# EAGLE design Controller_Board-v0-0-4 (EAGLE 5.06)
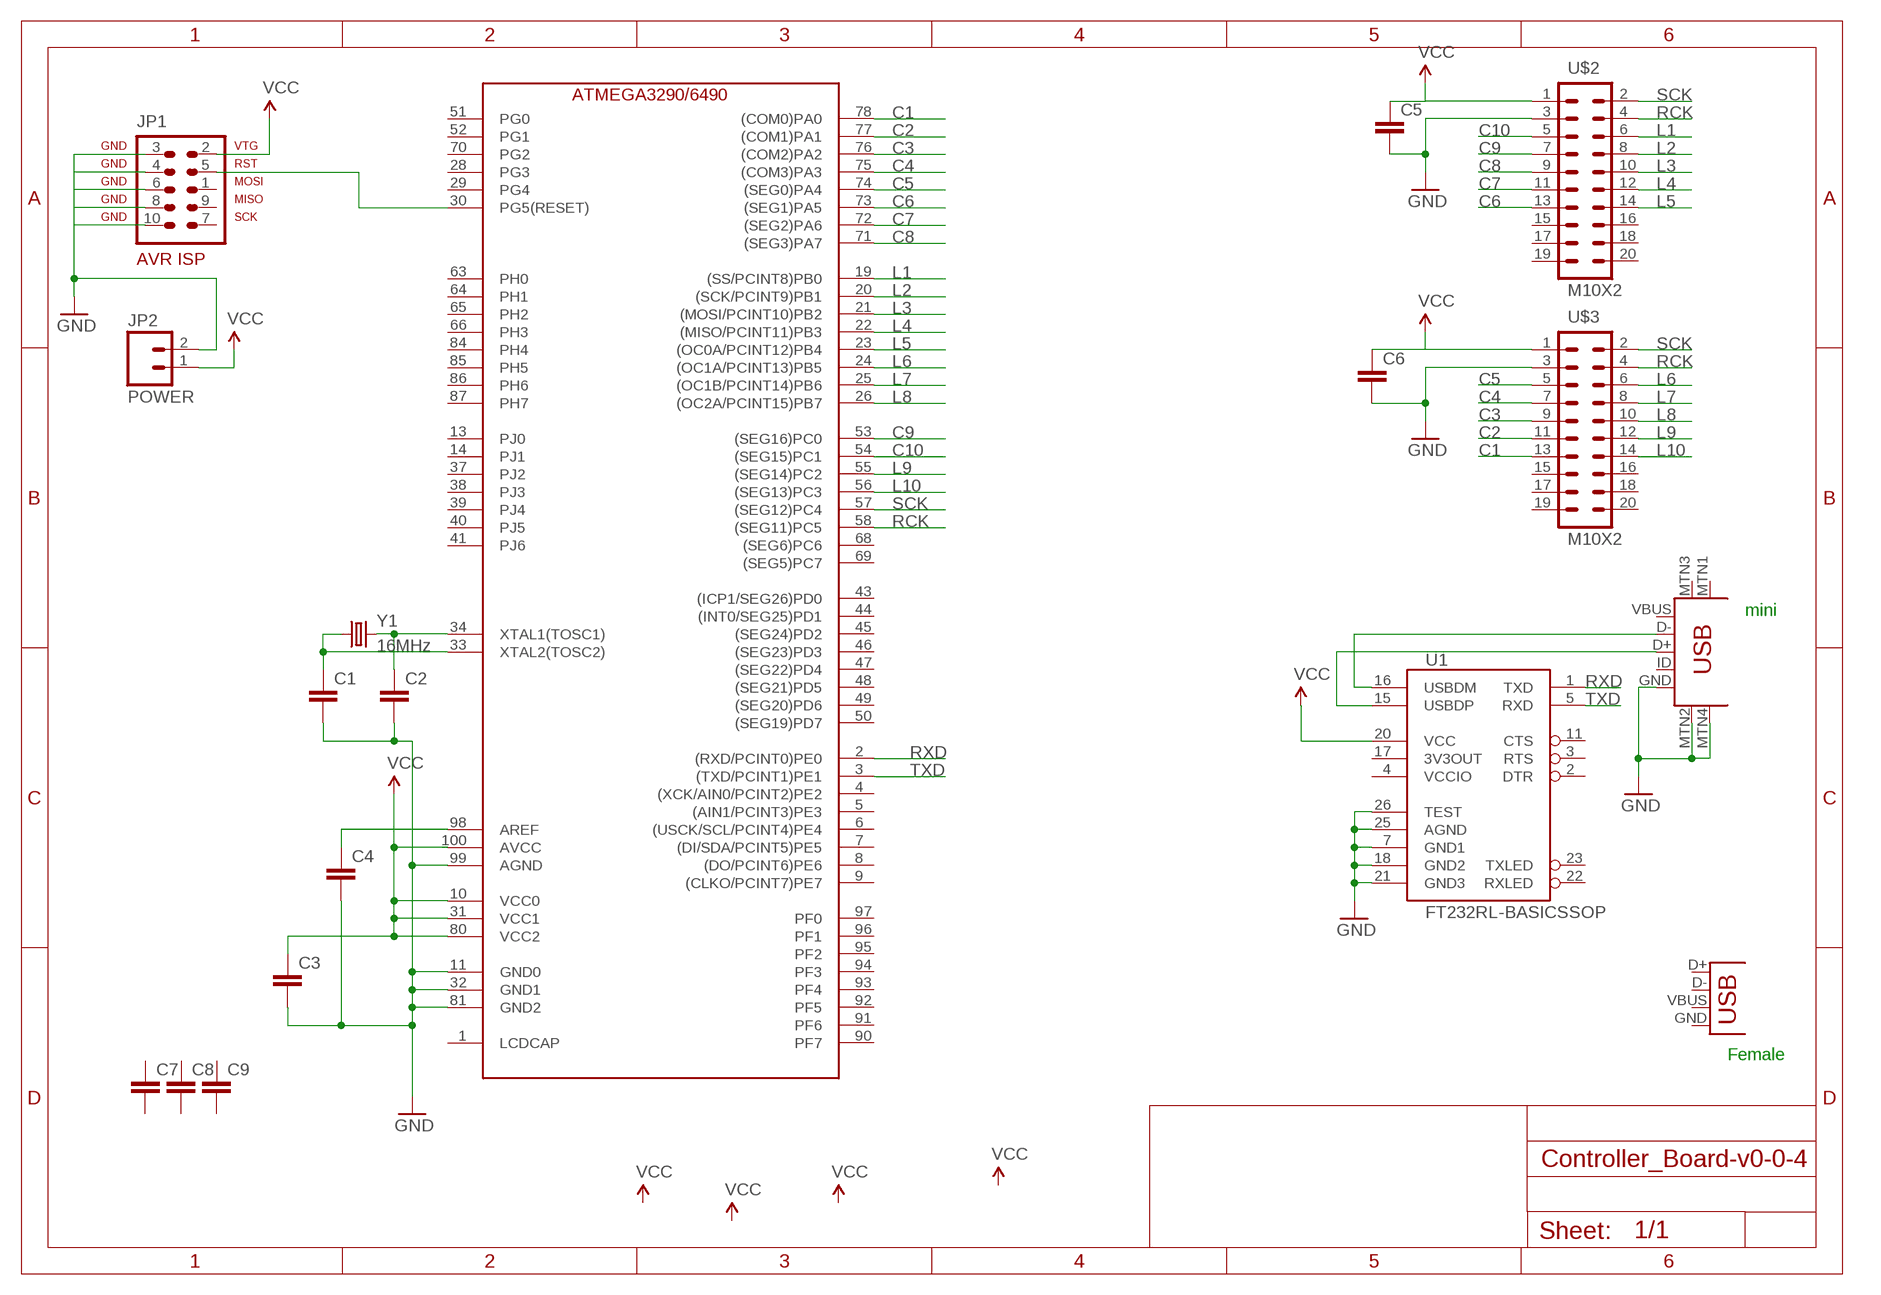
[diagram p0: schematic, sheet 1]

## Parts
C1  CAPPTH1  [CAP-PTH-5MM]
C2  CAPPTH1  [CAP-PTH-5MM]
C3  CAPPTH1  [CAP-PTH-5MM]
C4  CAPPTH1  [CAP-PTH-5MM]
C5  CAPPTH1  [CAP-PTH-5MM]
C6  CAPPTH1  [CAP-PTH-5MM]
C7  CAPPTH1  [CAP-PTH-5MM]
C8  CAPPTH1  [CAP-PTH-5MM]
C9  CAPPTH1  [CAP-PTH-5MM]
JP1  AVR-ISP-10  [AVR-ISP-10]
JP2  POWER  M02PTH  [1X02]
U1  FT232RL-BASICSSOP  [SSOP28DB]
U$1  MEGA3290  [TQFP100]
U$2  M10X2  [2X10]
U$3  M10X2  [2X10]
U$4  USB-MINIB-5PIN  [USB-MINIB]
X1  USB-A-SMD  [USB-A-S-NOSILK-FEMALE]
Y1  16MHz  CRYSTALHC49US  [HC49US]

## Nets
C1: U$1.78((COM0)PA0) U$3.13
C2: U$1.77((COM1)PA1) U$3.11
C3: U$1.76((COM2)PA2) U$3.9
C4: U$1.75((COM3)PA3) U$3.7
C5: U$1.74((SEG0)PA4) U$3.5
C6: U$1.73((SEG1)PA5) U$2.13
C7: U$1.72((SEG2)PA6) U$2.11
C8: U$1.71((SEG3)PA7) U$2.9
C9: U$1.53((SEG16)PC0) U$2.7
C10: U$1.54((SEG15)PC1) U$2.5
GND: C1.2 C2.2 C3.2 C4.2 C5.2 C6.2 JP1.3 JP1.4 JP1.6 JP1.8 JP1.10 JP2.2 U1.7(GND1) U1.18(GND2) U1.21(GND3) U1.25(AGND) U1.26(TEST) U$1.11(GND0) U$1.32(GND1) U$1.81(GND2) U$1.99(AGND) U$2.3 U$3.3 U$4.GND U$4.MTN2(MTN3) U$4.MTN4
L1: U$1.19((SS/PCINT8)PB0) U$2.6
L2: U$1.20((SCK/PCINT9)PB1) U$2.8
L3: U$1.21((MOSI/PCINT10)PB2) U$2.10
L4: U$1.22((MISO/PCINT11)PB3) U$2.12
L5: U$1.23((OC0A/PCINT12)PB4) U$2.14
L6: U$1.24((OC1A/PCINT13)PB5) U$3.6
L7: U$1.25((OC1B/PCINT14)PB6) U$3.8
L8: U$1.26((OC2A/PCINT15)PB7) U$3.10
L9: U$1.55((SEG14)PC2) U$3.12
L10: U$1.56((SEG13)PC3) U$3.14
N$1: U1.15(USBDP) U$4.D+
N$2: C4.1 U$1.98(AREF)
N$3: C2.1 U$1.34(XTAL1(TOSC1)) Y1.2
N$4: C1.1 U$1.33(XTAL2(TOSC2)) Y1.1
N$5: JP1.5 U$1.30(PG5(RESET))
N$6: U1.16(USBDM) U$4.D-
RCK: U$1.58((SEG11)PC5) U$2.4 U$3.4
RXD: U1.1(TXD) U$1.2((RXD/PCINT0)PE0)
SCK: U$1.57((SEG12)PC4) U$2.2 U$3.2
TXD: U1.5(RXD) U$1.3((TXD/PCINT1)PE1)
VCC: C3.1 C5.1 C6.1 JP1.2 JP2.1 U1.20(VCC) U$1.10(VCC0) U$1.31(VCC1) U$1.80(VCC2) U$1.100(AVCC) U$2.1 U$3.1
Unconnected: C7.1 C7.2 C8.1 C8.2 C9.1 C9.2 JP1.1 JP1.7 JP1.9 U1.2(DTR) U1.3(RTS) U1.11(CTS) U1.17(3V3OUT) U1.22(RXLED) U1.23(TXLED) U$1.1(LCDCAP) U$1.4((XCK/AIN0/PCINT2)PE2) U$1.5((AIN1/PCINT3)PE3) U$1.6((USCK/SCL/PCINT4)PE4) U$1.7((DI/SDA/PCINT5)PE5) U$1.8((DO/PCINT6)PE6) U$1.9((CLKO/PCINT7)PE7) U$1.13(PJ0) U$1.14(PJ1) U$1.28(PG3) U$1.29(PG4) U$1.37(PJ2) U$1.38(PJ3) U$1.39(PJ4) U$1.40(PJ5) U$1.41(PJ6) U$1.43((ICP1/SEG26)PD0) U$1.44((INT0/SEG25)PD1) U$1.45((SEG24)PD2) U$1.46((SEG23)PD3) U$1.47((SEG22)PD4) U$1.48((SEG21)PD5) U$1.49((SEG20)PD6) U$1.50((SEG19)PD7) U$1.51(PG0) U$1.52(PG1) U$1.63(PH0) U$1.64(PH1) U$1.65(PH2) U$1.66(PH3) U$1.68((SEG6)PC6) U$1.69((SEG5)PC7) U$1.70(PG2) U$1.84(PH4) U$1.85(PH5) U$1.86(PH6) U$1.87(PH7) U$1.90(PF7) U$1.91(PF6) U$1.92(PF5) U$1.93(PF4) U$1.94(PF3) U$1.95(PF2) U$1.96(PF1) U$1.97(PF0) U$2.15 U$2.16 U$2.17 U$2.18 U$2.19 U$2.20 U$3.15 U$3.16 U$3.17 U$3.18 U$3.19 U$3.20 U$4.ID U$4.MTN1(MTN2) U$4.MTN3(MTN1) U$4.VBUS X1.D+ X1.D- X1.GND X1.VBUS

## Notes on the sheet
- mini
- Female

## Power pins joined to a net without a drawn wire
VCCIO: U1.4(VCCIO)

## Library data of the parts
C1-C9 = SparkFun:CAP: Capacitor Standard 0603 ceramic capacitor, and 0.1" leaded capacitor.
JP1 = avr-7:AVR-ISP-10: AVR ISP-10 Serial Programming Header
JP2 = SparkFun:M02: Header 2 Standard 2-pin 0.1" header. Use with straight break away headers (SKU : PRT-00116), right angle break away headers (PRT-00553), swiss pins (PRT-00743), machine pins (PRT-00117), and female headers (PRT-00115). Molex polarized connector foot print use with SKU : PRT-08233 with associated crimp pins and housings.
U1 = SparkFun:FT232RL-BASIC: USB UART This is the simplified version of the FT232RL unit. Only what you need, nothing you don't. Spark Fun Electronics SKU : COM-00650
U$1 = avr-7:MEGA3290; ATMEGA3290: Microcontroller
U$2 U$3 = SparkFun:M10X2: This was SPECIALLY designed to be used with our Graphic LCD Backpack. Be sure you want to use this! It is not only staggered on each line of header holes, but IT IS ALSO offset of the center point of the top and bottom lines by 5 mil. This causes the headers to lock into place on the "standard" footprint on the LCD screen. The extra squares on the tdocu layer are there simply to reference other pins (if you were to actually populate a longer header than ten long - this is what we do with the backpacks).
U$4 = SparkFun:USB-MINIB: Mini-USB "B" connector with 5th pin broken out. Created new symbol breaking out 5th "ID" pin in mini/micro USB connector spec. See: http://en.wikipedia.org/wiki/Mini_usb#Cables. Uses same footprint as 4-pin symbol. Also added pins to connect to mounting / shield pads if required (probably not generally needed as signals aren't shielded once they leave the connector).
X1 = SparkFun:USB: USB Connectors USB-B-PTH is fully proven SKU : PRT-00139 USB-miniB is fully proven SKU : PRT-00587 USB-A-PCB is untested. USB-A-H is throughly reviewed, but untested. Spark Fun Electronics SKU : PRT-00437 USB-B-SMT is throughly reviewed, but untested. Needs silkscreen touching up. USB-A-S has not been used/tested USB-MB-H has not been used/tested
Y1 = SparkFun:CRYSTAL: Crystals Various standard crystals. Proven footprints. Spark Fun Electronics SKU : COM-00534

## Board
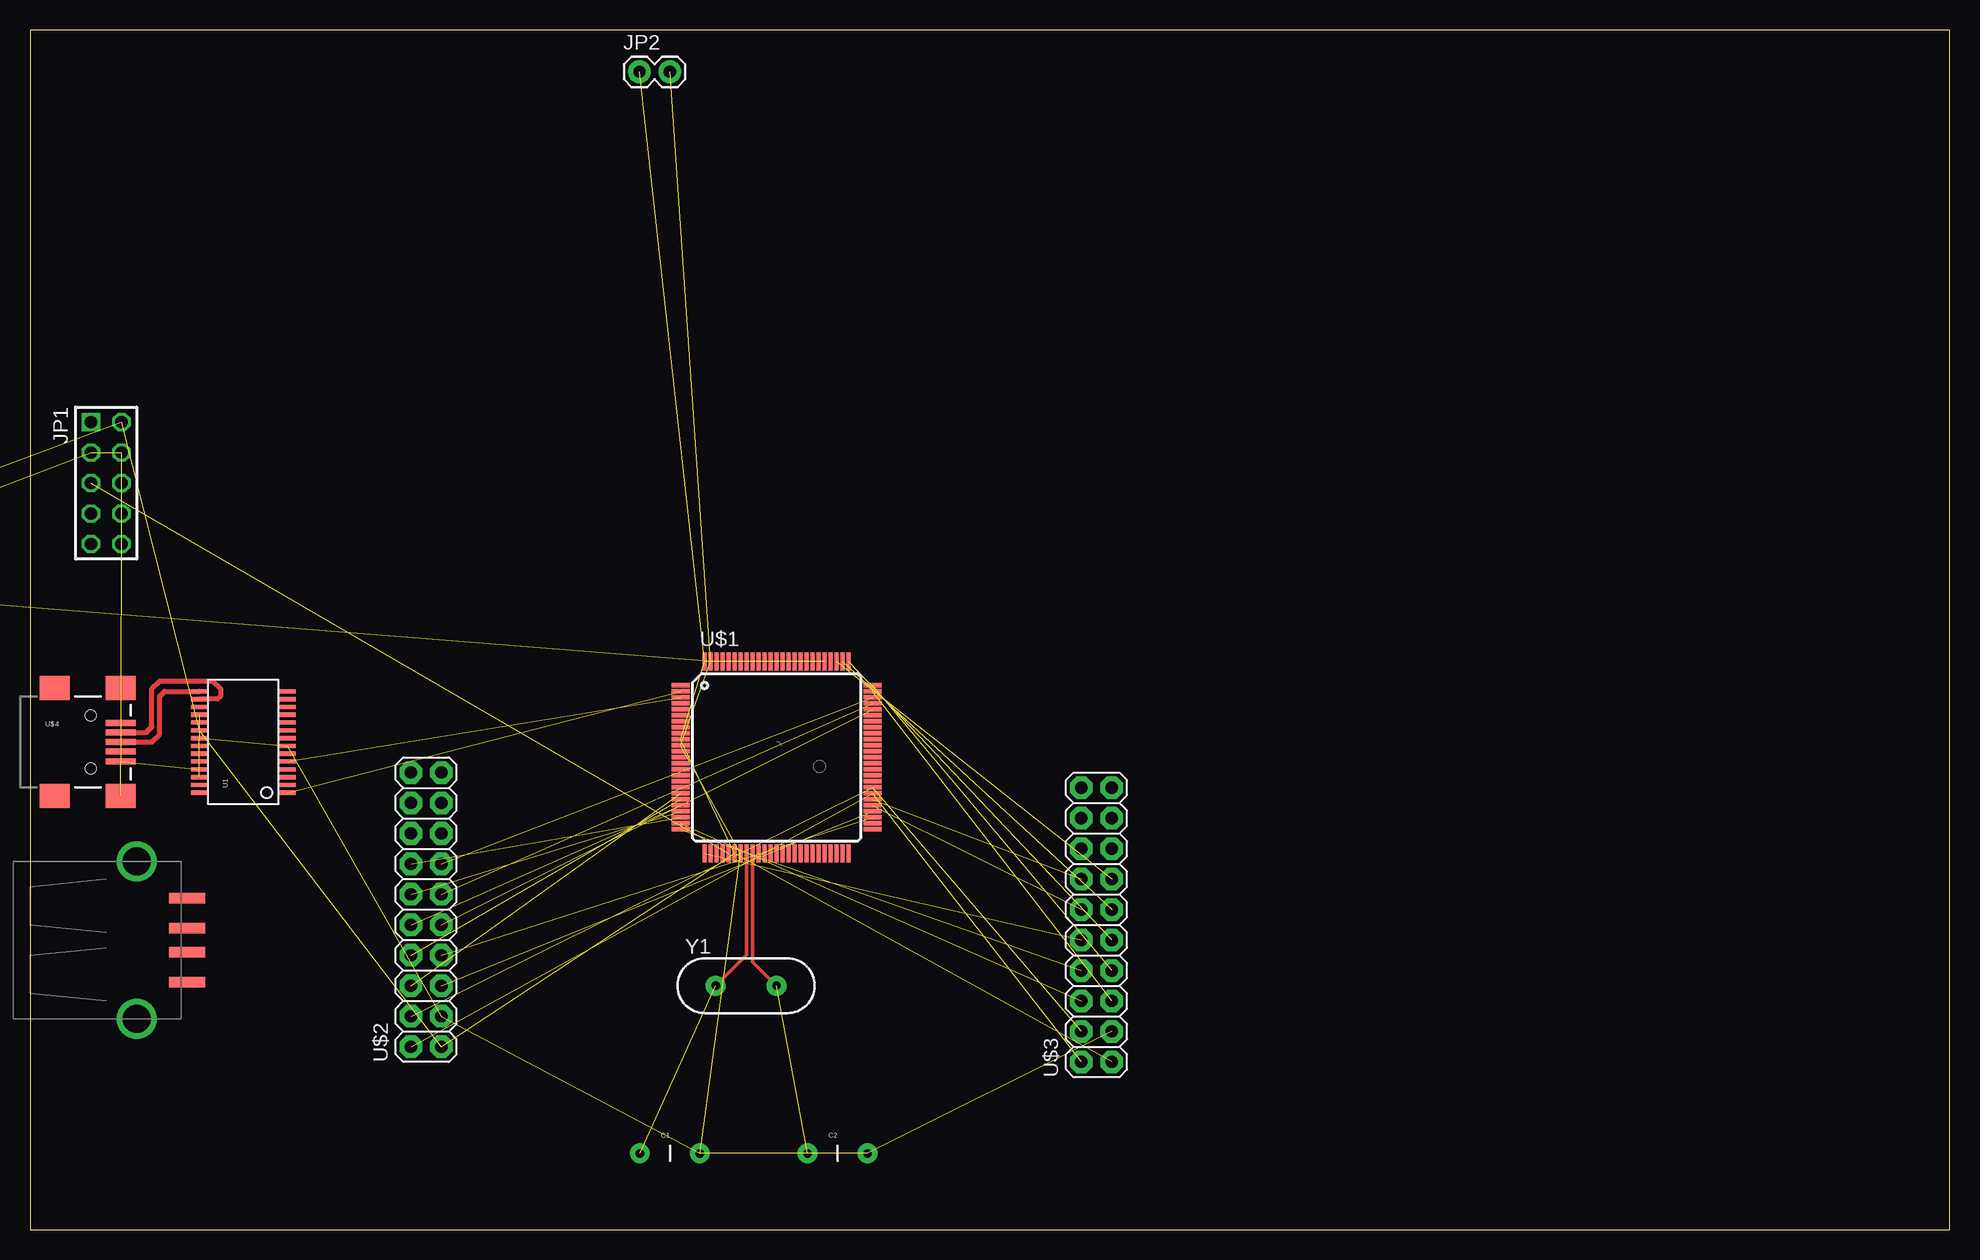
[diagram p1: board, top side]

Size 160 x 100 mm. Coordinates in mm from the lower left corner, seen from the top.
Outline: 0,0 160,0 160,100 0,100 0,0
Copper layers (1*16): Top 0.035mm / dielectric 1.5mm / Bottom 0.035mm
Design rules "default": minimum track width 10mil, minimum drill 24mil, track to track 8mil, track to pad 8mil, pad to pad 8mil, via to via 8mil, smd to smd 8mil, copper to edge 40mil, drill to drill 8mil, minimum pad ring 10mil, minimum via ring 8mil, stop-mask expansion 4mil, vias tented up to drill 0mil, thermal gap 10mil

### Footprints (pad centres in the part's own frame; a part is rotated, then mirrored left to right if it is on the bottom)
CAP-PTH-5MM = drill 0.7 pad 1.651 round: 1 -2.5,0; 2 2.5,0
AVR-ISP-10 = drill 1.016 square: 1 -5.08,-1.27 | drill 1.016 octagon: 2 -5.08,1.27; 3 -2.54,-1.27; 4 -2.54,1.27; 5 0,-1.27; 6 0,1.27; 7 2.54,-1.27; 8 2.54,1.27; 9 5.08,-1.27; 10 5.08,1.27
1X02 = drill 1.016 pad 1.88 round: 1 0,0; 2 2.54,0
SSOP28DB = smd 0.348 x 1.397: 1 -4.225,-3.656; 2 -3.575,-3.656; 3 -2.925,-3.656; 4 -2.275,-3.656; 5 -1.625,-3.656; 6 -0.975,-3.656; 7 -0.325,-3.656; 8 0.325,-3.656; 9 0.975,-3.656; 10 1.625,-3.656; 11 2.275,-3.656; 12 2.925,-3.656; 13 3.575,-3.656; 14 4.225,-3.656; 15 4.225,3.656; 16 3.575,3.656; 17 2.925,3.656; 18 2.275,3.656; 19 1.625,3.656; 20 0.975,3.656; 21 0.325,3.656; 22 -0.325,3.656; 23 -0.975,3.656; 24 -1.625,3.656; 25 -2.275,3.656; 26 -2.925,3.656; 27 -3.575,3.656; 28 -4.225,3.656
TQFP100 = smd 1.5 x 0.35: 1 -8,6; 2 -8,5.5; 3 -8,5; 4 -8,4.5; 5 -8,4; 6 -8,3.5; 7 -8,3; 8 -8,2.5; 9 -8,2; 10 -8,1.5; 11 -8,1; 12 -8,0.5; 13 -8,0; 14 -8,-0.5; 15 -8,-1; 16 -8,-1.5; 17 -8,-2; 18 -8,-2.5; 19 -8,-3; 20 -8,-3.5; 21 -8,-4; 22 -8,-4.5; 23 -8,-5; 24 -8,-5.5; 25 -8,-6; 51 8,-6; 52 8,-5.5; 53 8,-5; 54 8,-4.5; 55 8,-4; 56 8,-3.5; 57 8,-3; 58 8,-2.5; 59 8,-2; 60 8,-1.5; 61 8,-1; 62 8,-0.5; 63 8,0; 64 8,0.5; 65 8,1; 66 8,1.5; 67 8,2; 68 8,2.5; 69 8,3; 70 8,3.5; 71 8,4; 72 8,4.5; 73 8,5; 74 8,5.5; 75 8,6 | smd 0.35 x 1.5: 26 -6,-8; 27 -5.5,-8; 28 -5,-8; 29 -4.5,-8; 30 -4,-8; 31 -3.5,-8; 32 -3,-8; 33 -2.5,-8; 34 -2,-8; 35 -1.5,-8; 36 -1,-8; 37 -0.5,-8; 38 0,-8; 39 0.5,-8; 40 1,-8; 41 1.5,-8; 42 2,-8; 43 2.5,-8; 44 3,-8; 45 3.5,-8; 46 4,-8; 47 4.5,-8; 48 5,-8; 49 5.5,-8; 50 6,-8; 76 6,8; 77 5.5,8; 78 5,8; 79 4.5,8; 80 4,8; 81 3.5,8; 82 3,8; 83 2.5,8; 84 2,8; 85 1.5,8; 86 1,8; 87 0.5,8; 88 0,8; 89 -0.5,8; 90 -1,8; 91 -1.5,8; 92 -2,8; 93 -2.5,8; 94 -3,8; 95 -3.5,8; 96 -4,8; 97 -4.5,8; 98 -5,8; 99 -5.5,8; 100 -6,8
2X10 = drill 1.016 pad 1.88 octagon: 1 -11.43,-1.27; 2 -11.43,1.27; 3 -8.89,-1.27; 4 -8.89,1.27; 5 -6.35,-1.27; 6 -6.35,1.27; 7 -3.81,-1.27; 8 -3.81,1.27; 9 -1.27,-1.27; 10 -1.27,1.27; 11 1.27,-1.27; 12 1.27,1.27; 13 3.81,-1.27; 14 3.81,1.27; 15 6.35,-1.27; 16 6.35,1.27; 17 8.89,-1.27; 18 8.89,1.27; 19 11.43,-1.27; 20 11.43,1.27
USB-MINIB = smd 2.5 x 0.5: D+ 2.5,0; D- 2.5,0.8; GND 2.5,-1.6; ID 2.5,-0.8; VBUS 2.5,1.6 | smd 2.5 x 2: MTN1 -3,4.5; MTN2 2.5,4.5; MTN3 -3,-4.5; MTN4 2.5,-4.5 | hole 0.9: 0,2.2; 0,-2.2
USB-A-S-NOSILK-FEMALE = smd 3 x 0.9: D+ 4.212,-1; D- 4.212,1; GND 4.212,-3.5; VBUS 4.212,3.5 | drill 2.311 round: P$5 0,-6.566; P$6 0,6.566
HC49US = drill 0.7 pad 1.651 round: 1 -2.54,0; 2 2.54,0

### Placement (x,y rotation side)
C1  53.34,6.35 0 top
C2  67.31,6.35 0 top
C3  -24.13,54.61 0 top  (outside the outline)
C4  -31.75,54.61 0 top  (outside the outline)
C5  -39.37,54.61 0 top  (outside the outline)
C6  -46.99,54.61 0 top  (outside the outline)
C7  -54.61,54.61 0 top  (outside the outline)
C8  -16.51,58.42 0 top  (outside the outline)
C9  -24.13,58.42 0 top  (outside the outline)
JP1  6.35,62.23 270 top
JP2  50.8,96.52 0 top
U1  17.78,40.64 90 top
U$1  62.23,39.37 0 top
U$2  33.02,26.67 90 top
U$3  88.9,25.4 90 top
U$4  5.08,40.64 0 top
X1  8.89,24.13 0 top
Y1  59.69,20.32 0 top

### Tracks (layer width: path | path; a pad name or v marks a point on that pad's centre or on a via)
C1  (1 unrouted)
C2  (1 unrouted)
C3  (1 unrouted)
C4  (1 unrouted)
C5  (1 unrouted)
C6  (1 unrouted)
C7  (1 unrouted)
C8  (1 unrouted)
C9  (1 unrouted)
C10  (1 unrouted)
GND  (25 unrouted)
L1  (1 unrouted)
L2  (1 unrouted)
L3  (1 unrouted)
L4  (1 unrouted)
L5  (1 unrouted)
L6  (1 unrouted)
L7  (1 unrouted)
L8  (1 unrouted)
L9  (1 unrouted)
L10  (1 unrouted)
N$1
  Top 0.406: U$4.D+ 10.16,40.64 10.79,41.27 10.79,44.45 11.21,44.87 U1.15
N$2  (1 unrouted)
N$3  (1 unrouted)
  Top 0.305: U$1.34 60.23,22.32 Y1.2
N$4  (1 unrouted)
  Top 0.305: U$1.33 59.73,22.9 Y1.1
N$5  (1 unrouted)
N$6
  Top 0.406: U$4.D- 9.69,41.44 10.16,41.91 10.16,45.09 10.79,45.72 15.24,45.72 15.88,45.09 15.88,44.45 15.64,44.22 U1.16
RCK  (2 unrouted)
RXD  (1 unrouted)
SCK  (2 unrouted)
TXD  (1 unrouted)
VCC  (11 unrouted)